# Altium schematic sheet 03_Mos.SchDoc
size A4
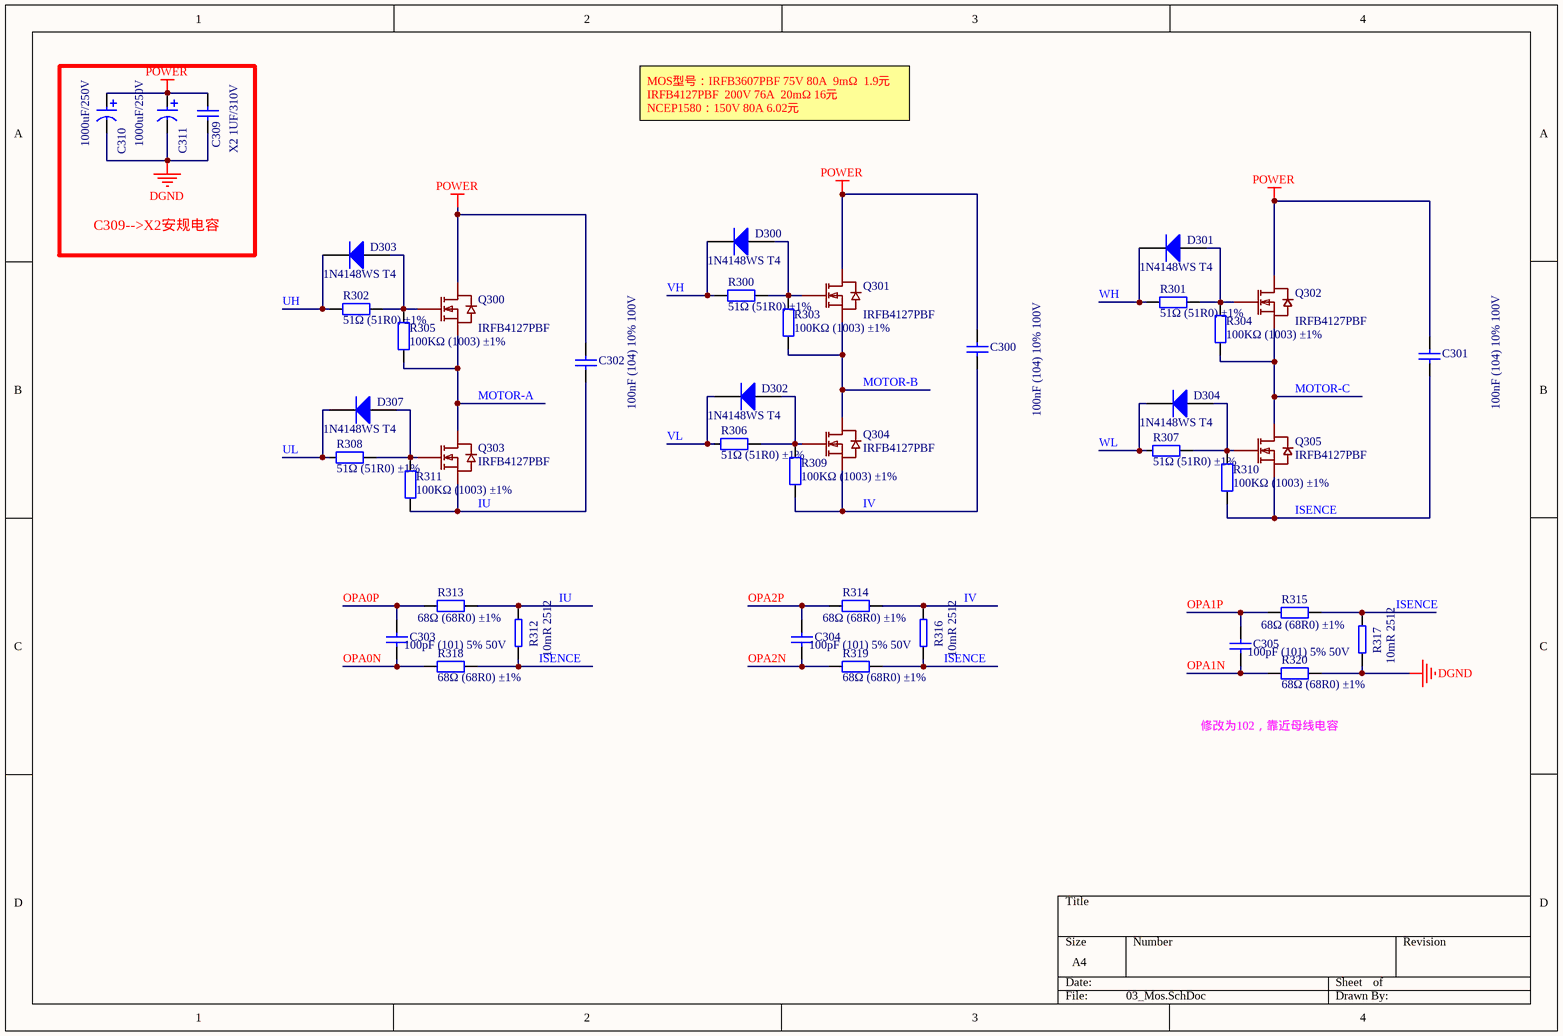
[diagram p0: 03_Mos.SchDoc]

## Parts
C300  100nF (104) 10% 100V  [1206_C]
C301  100nF (104) 10% 100V  [1206_C]
C302  100nF (104) 10% 100V  [1206_C]
C303  100pF (101) 5% 50V  [0805_C]
C304  100pF (101) 5% 50V  [0805_C]
C305  100pF (101) 5% 50V  [0805_C]
C309  X2 1UF/310V  [X2 1UF 310V]
C310  1000uF/250V  [1000uf/250V]
C311  1000uF/250V  [1000uf/250V]
D300  1N4148WS T4  [SOD-323]
D301  1N4148WS T4  [SOD-323]
D302  1N4148WS T4  [SOD-323]
D303  1N4148WS T4  [SOD-323]
D304  1N4148WS T4  [SOD-323]
D307  1N4148WS T4  [SOD-323]
Q300  IRFB4127PBF  [IRFB4127]
Q301  IRFB4127PBF  [IRFB4127]
Q302  IRFB4127PBF  [IRFB4127]
Q303  IRFB4127PBF  [IRFB4127]
Q304  IRFB4127PBF  [IRFB4127]
Q305  IRFB4127PBF  [IRFB4127]
R300  51Ω (51R0) ±1%  [0805_R]
R301  51Ω (51R0) ±1%  [0805_R]
R302  51Ω (51R0) ±1%  [0805_R]
R303  100KΩ (1003) ±1%  [0805_R]
R304  100KΩ (1003) ±1%  [0805_R]
R305  100KΩ (1003) ±1%  [0805_R]
R306  51Ω (51R0) ±1%  [0805_R]
R307  51Ω (51R0) ±1%  [0805_R]
R308  51Ω (51R0) ±1%  [0805_R]
R309  100KΩ (1003) ±1%  [0805_R]
R310  100KΩ (1003) ±1%  [0805_R]
R311  100KΩ (1003) ±1%  [0805_R]
R312  10mR 2512  [R2512]
R313  68Ω (68R0) ±1%  [0805_R]
R314  68Ω (68R0) ±1%  [0805_R]
R315  68Ω (68R0) ±1%  [0805_R]
R316  10mR 2512  [R2512]
R317  10mR 2512  [R2512]
R318  68Ω (68R0) ±1%  [0805_R]
R319  68Ω (68R0) ±1%  [0805_R]
R320  68Ω (68R0) ±1%  [0805_R]

## Blocks framed on the sheet
C309-->X2安规电容: C309-C311

## Nets
DGND: C309.1 C310.2 C311.2 R317.1 R320.2
POWER: C300.2 C301.2 C302.2 C309.2 C310.1 C311.1 Q300.2(D) Q301.2(D) Q302.2(D)
ISENCE: C301.1 Q305.3(S) R310.1 R312.1 R315.2 R316.1 R317.2 R318.2 R319.2
IU: C302.1 Q303.3(S) R311.1 R312.2 R313.2
IV: C300.1 Q304.3(S) R309.1 R314.2 R316.2
MOTOR-A: Q300.3(S) Q303.2(D) R305.1
MOTOR-B: Q301.3(S) Q304.2(D) R303.1
MOTOR-C: Q302.3(S) Q305.2(D) R304.1
OPA0N: C303.1 R318.1
OPA0P: C303.2 R313.1
OPA1N: C305.1 R320.1
OPA1P: C305.2 R315.1
OPA2N: C304.1 R319.1
OPA2P: C304.2 R314.1
UH: D303.2(K) R302.1
UL: D307.2(K) R308.1
VH: D300.2(K) R300.1
VL: D302.2(K) R306.1
WH: D301.2(K) R301.1
WL: D304.2(K) R307.1
NetD300_1: D300.1(A) Q301.1(G) R300.2 R303.2
NetD301_1: D301.1(A) Q302.1(G) R301.2 R304.2
NetD302_1: D302.1(A) Q304.1(G) R306.2 R309.2
NetD303_1: D303.1(A) Q300.1(G) R302.2 R305.2
NetD304_1: D304.1(A) Q305.1(G) R307.2 R310.2
NetD307_1: D307.1(A) Q303.1(G) R308.2 R311.2

## Notes on the sheet
- MOS型号：IRFB3607PBF 75V 80A  9mΩ  1.9元   IRFB4127PBF  200V 76A  20mΩ 16元      NCEP1580：150V 80A 6.02元
- 修改为102，靠近母线电容

## Library data of the parts
C300-C302 C309 = 1206 100nF (104) 10% 50V: 贴片电容; ComponentLink1Description: 供应商链接; ComponentLink1URL: http://www.szlcsc.com/product/details_25237.html; Package: 1206; Supplier: LC; SuppliersPartNumber: C24497
C303-C305 = 0805 100pF (101) 5% 50V: 贴片电容; ComponentLink1Description: 供应商链接; ComponentLink1URL: http://www.szlcsc.com/product/details_2142.html; Package: 0805; Supplier: LC; SuppliersPartNumber: C1790
C310 C311 = CAP2: 电解电容
D300-D304 D307 = SOD-323 1N4148WS T4: 二极管; ComponentLink1Description: 供应商链接; ComponentLink1URL: http://www.szlcsc.com/product/details_2485.html; Package: SOD-323; Supplier: LC; SuppliersPartNumber: C2128
R300-R302 R306-R308 = 0805 51Ω (51R0) 1%: 贴片电阻; ComponentLink1Description: 供应商链接; ComponentLink1URL: http://www.szlcsc.com/product/details_18426.html; Package: 0805; Supplier: LC; SuppliersPartNumber: C17738
R303-R305 R309-R311 = 0805 100KΩ (1003) 1%: 贴片电阻; ComponentLink1Description: 供应商链接; ComponentLink1URL: http://www.szlcsc.com/product/details_18095.html; Package: 0805; Supplier: LC; SuppliersPartNumber: C17407
R312 R316 R317 = Res10K
R313-R315 R318-R320 = 0805 68Ω (68R0) 1%: 贴片电阻; ComponentLink1Description: 供应商链接; ComponentLink1URL: http://www.szlcsc.com/product/details_18490.html; Package: 0805; Supplier: LC; SuppliersPartNumber: C17802